# Altium schematic sheet STM.SchDoc
size A4; SheetNumber: 2; SheetTotal: 4
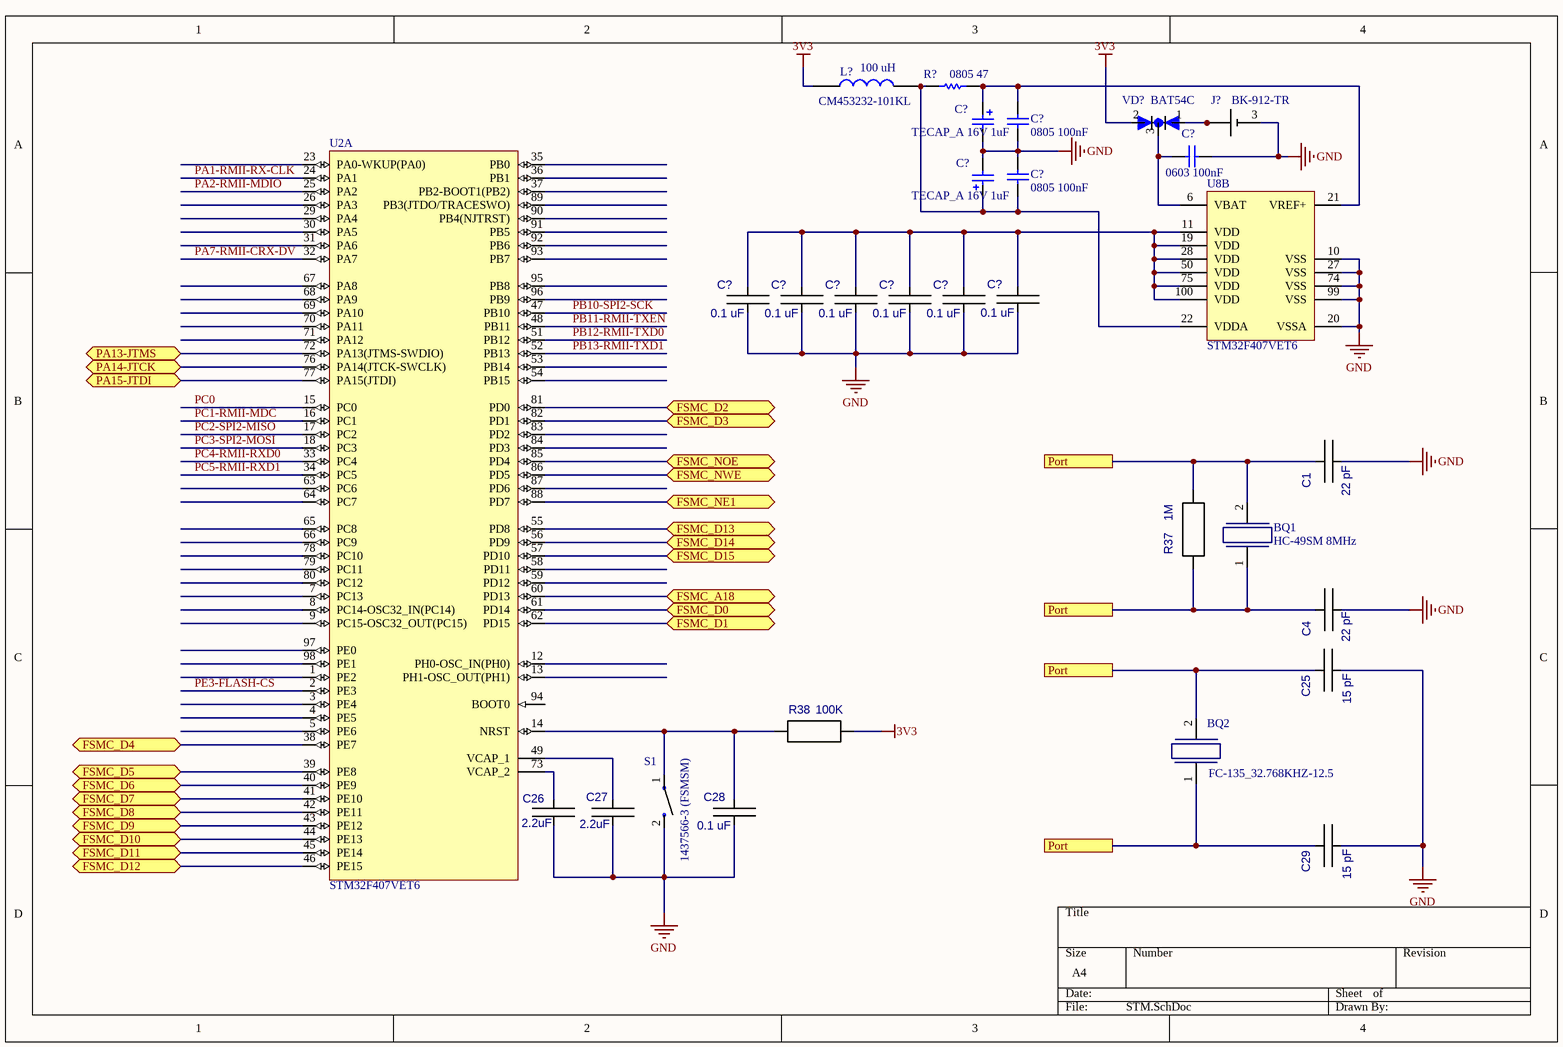
[diagram p0: STM.SchDoc]

## Parts
(Parts that share a designator on the sheet are numbered #1, #2 ... from top to bottom, then left to right.)
BQ1  HC-49SM 8MHz  [HC49SM]
BQ2  FC-135_32.768KHZ-12.5  [FC-135]
C1  22 pF  [CAP_0805]
C4  22 pF  [CAP_0805]
C25  15 pF  [CAP_0805]
C26  2.2uF  [CAP_0805]
C27  2.2uF  [CAP_0805]
C28  0.1 uF  [CAP_0805]
C29  15 pF  [CAP_0805]
C?#1  TECAP_A 16V 1uF  [TECAP_A]
C?#2  0805 100nF  [C_SMD0805]
C?#3  0603 100nF  [C_SMD0603]
C?#4  TECAP_A 16V 1uF  [TECAP_A]
C?#5  0805 100nF  [C_SMD0805]
C?#6  0.1 uF  [CAP_0805]
C?#7  0.1 uF  [CAP_0805]
C?#8  0.1 uF  [CAP_0805]
C?#9  0.1 uF  [CAP_0805]
C?#10  0.1 uF  [CAP_0805]
C?#11  0.1 uF  [CAP_0805]
J?  BK-912-TR  [BK-912-TR]
L?  CM453232-101KL  [CM453232-101KL]
R37  1M  [RES_0805]
R38  100K  [RES_0805]
R?  0805 47  [R_SMD0805]
S1  1437566-3 (FSMSM)  [1437566-3]  (value not drawn)
U2  STM32F407VET6  [STM-LQFP100_V]  (part A of 2)
U8  STM32F407VET6  [STM-LQFP100_V]  (part B of 2)
VD?  BAT54C  [BAT54C_SOT23-3]

## Ports
FSMC_A18 (bidir), FSMC_D0 (bidir), FSMC_D1 (bidir), FSMC_D2 (bidir), FSMC_D3 (bidir), FSMC_D4 (bidir), FSMC_D5 (bidir), FSMC_D6 (bidir), FSMC_D7 (bidir), FSMC_D8 (bidir), FSMC_D9 (bidir), FSMC_D10 (bidir), FSMC_D11 (bidir), FSMC_D12 (bidir), FSMC_D13 (bidir), FSMC_D14 (bidir), FSMC_D15 (bidir), FSMC_NE1 (bidir), FSMC_NOE (bidir), FSMC_NWE (bidir), PA13-JTMS (bidir), PA14-JTCK (bidir), PA15-JTDI (bidir), Port

## Nets
3V3: L?.1 R38.1 VD?.2(A2)
GND: C1.2 C4.2 C25.2 C26.2 C27.2 C28.2 C29.2 C?#1.2 C?#2.1 C?#3.1 C?#4.2 C?#5.2 C?#6.2 C?#7.2 C?#8.2 C?#9.2 C?#10.2 C?#11.2 J?.3(NEG) S1.2 U8.10(VSS) U8.20(VSSA) U8.27(VSS) U8.74(VSS) U8.99(VSS)
FSMC_A18: U2.60(PD13) ; port FSMC_A18
FSMC_D0: U2.61(PD14) ; port FSMC_D0
FSMC_D1: U2.62(PD15) ; port FSMC_D1
FSMC_D2: U2.81(PD0) ; port FSMC_D2
FSMC_D3: U2.82(PD1) ; port FSMC_D3
FSMC_D4: U2.38(PE7) ; port FSMC_D4
FSMC_D5: U2.39(PE8) ; port FSMC_D5
FSMC_D6: U2.40(PE9) ; port FSMC_D6
FSMC_D7: U2.41(PE10) ; port FSMC_D7
FSMC_D8: U2.42(PE11) ; port FSMC_D8
FSMC_D9: U2.43(PE12) ; port FSMC_D9
FSMC_D10: U2.44(PE13) ; port FSMC_D10
FSMC_D11: U2.45(PE14) ; port FSMC_D11
FSMC_D12: U2.46(PE15) ; port FSMC_D12
FSMC_D13: U2.55(PD8) ; port FSMC_D13
FSMC_D14: U2.56(PD9) ; port FSMC_D14
FSMC_D15: U2.57(PD10) ; port FSMC_D15
FSMC_NE1: U2.88(PD7) ; port FSMC_NE1
FSMC_NOE: U2.85(PD4) ; port FSMC_NOE
FSMC_NWE: U2.86(PD5) ; port FSMC_NWE
PA1-RMII-RX-CLK: U2.24(PA1)
PA2-RMII-MDIO: U2.25(PA2)
PA7-RMII-CRX-DV: U2.32(PA7)
PA13-JTMS: U2.72(PA13(JTMS-SWDIO)) ; port PA13-JTMS
PA14-JTCK: U2.76(PA14(JTCK-SWCLK)) ; port PA14-JTCK
PA15-JTDI: U2.77(PA15(JTDI)) ; port PA15-JTDI
PB10-SPI2-SCK: U2.47(PB10)
PB11-RMII-TXEN: U2.48(PB11)
PB12-RMII-TXD0: U2.51(PB12)
PB13-RMII-TXD1: U2.52(PB13)
PC0: U2.15(PC0)
PC1-RMII-MDC: U2.16(PC1)
PC2-SPI2-MISO: U2.17(PC2)
PC3-SPI2-MOSI: U2.18(PC3)
PC4-RMII-RXD0: U2.33(PC4)
PC5-RMII-RXD1: U2.34(PC5)
PE3-FLASH-CS: U2.2(PE3)
Port: BQ1.1 BQ1.2 BQ2.1 BQ2.2 C1.1 C4.1 C25.1 C29.1 R37.1 R37.2 ; port Port
NetC26_1: C26.1 U2.73(VCAP_2)
NetC27_1: C27.1 U2.49(VCAP_1)
NetC28_1: C28.1 R38.2 S1.1 U2.14(NRST)
NetC?#1_1: C?#1.1 C?#2.2 R?.2 U8.21(VREF+)
NetC?#3_2: C?#3.2 U8.6(VBAT) VD?.3(C)
NetC?#4_1: C?#4.1 C?#5.1 L?.2 R?.1 U8.22(VDDA)
NetC?#6_1: C?#6.1 C?#7.1 C?#8.1 C?#9.1 C?#10.1 C?#11.1 U8.11(VDD) U8.19(VDD) U8.28(VDD) U8.50(VDD) U8.75(VDD) U8.100(VDD)
NetJ?_1: J?.1(POS) J?.2(POS) VD?.1(A1)

Not connected (* = marked no-connect by the designer): U2 1(PE2) 3(PE4) 4(PE5) 5(PE6) 7(PC13) 8(PC14-OSC32_IN(PC14)) 9(PC15-OSC32_OUT(PC15)) 12(PH0-OSC_IN(PH0)) 13(PH1-OSC_OUT(PH1)) 23(PA0-WKUP(PA0)) 26(PA3) 29(PA4) 30(PA5) 31(PA6) 35(PB0) 36(PB1) 37(PB2-BOOT1(PB2)) 53(PB14) 54(PB15) 58(PD11) 59(PD12) 63(PC6) 64(PC7) 65(PC8) 66(PC9) 67(PA8) 68(PA9) 69(PA10) 70(PA11) 71(PA12) 78(PC10) 79(PC11) 80(PC12) 83(PD2) 84(PD3) 87(PD6) 89(PB3(JTDO/TRACESWO)) 90(PB4(NJTRST)) 91(PB5) 92(PB6) 93(PB7) 94(BOOT0) 95(PB8) 96(PB9) 97(PE0) 98(PE1)

## Notes on the sheet
- (near L?) 100 uH
- (near S1) 1437566-3 (FSMSM)

## Library data of the parts
BQ1 = HC49SM
BQ2 = FC135-32768-7: Clock SMD Crystal
C1 C4 C25-C29 C?#6-C?#11 = CAP_0805: Value: *
C?#1 C?#4 = TECAP_A: Tantalum pol cap type A
C?#2 C?#5 = C0805: SMD Cap 0805; Note: Footprint corresponds to dimensions for bulk cassette packaging. This case size has tightened tolerances.; Published: 17-Jul-2002; LatestRevisionDate: 19-Mar-2004; LatestRevisionNote: Silkscreen size reduced.; DatasheetDocument: Mar-2001; PackageDocument: Mar-2001; PackageReference: 0805; Publisher: Altium Limited; Code_JEITA: 0805; Code_IPC: 2012[0805]; ComponentLink1Description: Manufacturer Link; ComponentLink1URL: http://www.kemet.com/; ComponentLink2Description: Datasheet; ComponentLink2URL: http://www.kemet.com/kemet/web/homepage/kechome.nsf/vapubfilesname/F3102TA.pdf/$file/F3102TA.pdf
C?#3 = C0603: SMD Cap 0603
J? = BK-912-TR: Holder Coin Cell 20mm Smd
L? = CM453232-471KL: BOURNS - CM453232-101KL - INDUCTOR, 4532 CASE, 100UH; Allied_Number: 70154277; Geometry.Height: 3.4mm; Manufacturer_Name: Bourns; Manufacturer_Part_Number: CM453232-471KL; RS Part Number: 6934353; RS Price/Stock: http://uk.rs-online.com/web/p/products/6934353; Allied Price/Stock: https://www.alliedelec.com/bourns-cm453232-471kl/70154277/; Arrow Part Number: CM453232-471KL; Arrow Price/Stock: https://www.arrow.com/en/products/cm453232-471kl/bourns; Datasheet Link: https://www.bourns.com/pdfs/cm.pdf
R37 R38 = RES_0805: Value: *
R? = R0805: SMD Res 0805
S1 = 1437566-3: FSMSM=3.5X6 SMT TACT; Configuration_Pole-Throw: Single Pole - Single Throw; Contact_Current_Rating: 50 mA; MF: TE Connectivity; MP: 1437566-3; SnapEDA_Link: https://www.snapeda.com/parts/1437566-3/TE%20Connectivity/view-part/?ref=snap; Package: None; Availability: Unavailable; Price: None; Value: *
U2 U8 = STM32F407VET6: ARM Cortex-M4 32-bit MCU+FPU, 210 DMIPS, 512 kB Flash, 192 kB Internal RAM, 82 I/Os, 100-pin LQFP, -40 to 85 degC, Tray; Manufacturer: STMicroelectronics; D/A Converter: 2x12-bit; FLASH Size (Prog) (kB): 512; I/Os (High Current): 82; Internal RAM Size (kB): 192; Operating Frequency(F) (Processor speed) (MHz): 168; Supply Voltage(Vcc) max (V): 3.6; Supply Voltage(Vcc) min (V): 1.8; DatasheetVersion: Rev. 4; PackageVersion: Rev. 1, 06/2013; PackageReference: LQFP100; PackageDescription: 100-Pin Low Profile Quad Flat Package, 14 x 14 mm Body, 0.5 mm Pitch; Supplier 1: Digi-Key; Supplier Part Number 1: 497-12075-ND; Supplier 2: Farnell; Supplier Part Number 2: 2064367; Supplier 3: Newark; Supplier Part Number 3: 73T2332; Supplier 4: Mouser; Supplier Part Number 4: 511-STM32F407VET6; Core: ARM Cortex-M4; Packing: Tray; Mounting Technology: Surface Mount; PartNumber: STM32F407VET6; ComponentLink1Description: Manufacturer URL; ComponentLink1URL: http://www.st.com/web/en/home.html; ComponentLink2Description: Datasheet; ComponentLink2URL: http://www.st.com/st-web-ui/static/active/en/resource/technical/document/datasheet/DM00037051.pdf; ComponentLink3Description: Package Specification; ComponentLink3URL: http://www.st.com/st-web-ui/static/active/en/resource/technical/document/data_brief/DM00071938.pdf
VD? = BAT54C: Small Signal Schottky Diode, Dual Common Cathode, 30 V, 200 mA, 400 mV, 600 mA, 125 C